# Altium schematic sheet [04] SQ3, SQ11.SchDoc
size 203 x 152 mm
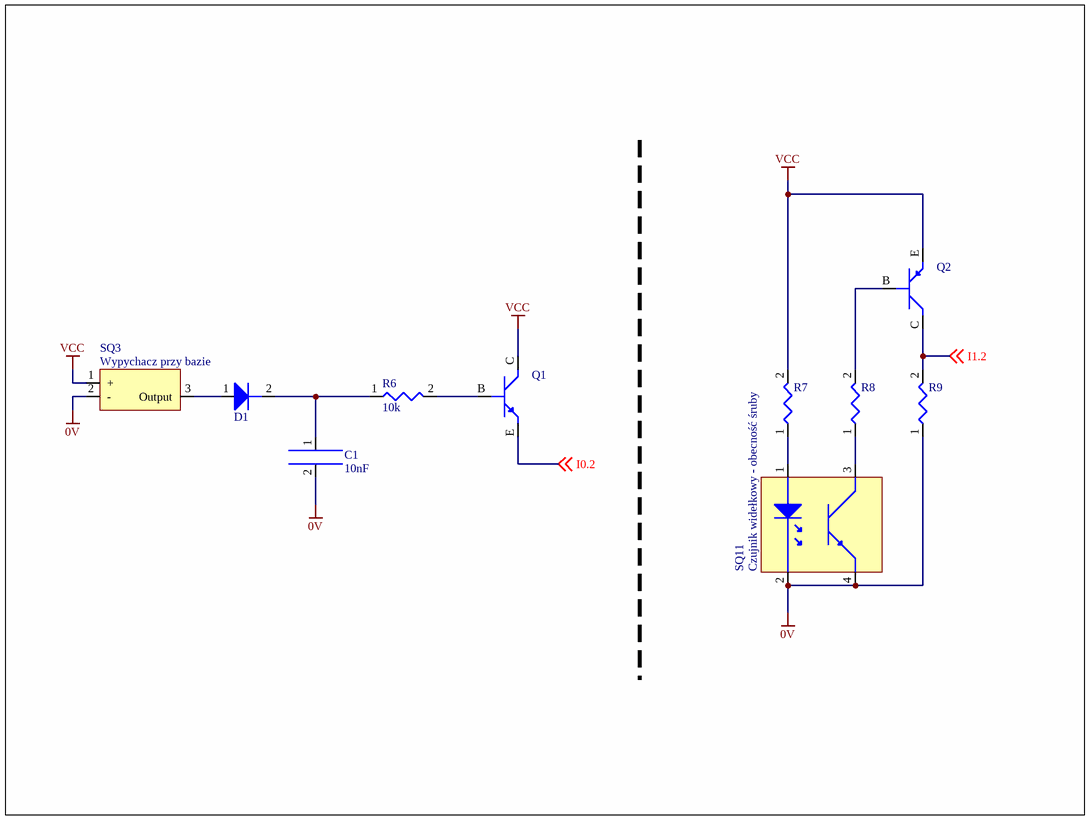
[diagram p0: [04] SQ3, SQ11.SchDoc]

## Parts
C1  10nF
D1  Dioda prostownicza  (value not drawn)
Q1  Transistor NPN  (value not drawn)
Q2  PNP Transistor  (value not drawn)
R6  10k
R7  ?R?  (value not drawn)
R8  ?R?  (value not drawn)
R9  ?R?  (value not drawn)
SQ3  Wypychacz przy bazie
SQ11  Czujnik widełkowy - obecność śruby

## Nets
0V: C1.2 R9.1 SQ3.2(-) SQ11.2(-) SQ11.4
VCC: Q1.C Q2.E R7.2 SQ3.1(+)
I0.2: Q1.E ; off-sheet I0.2
I1.2: Q2.C R9.2 ; off-sheet I1.2
NetC1_1: C1.1 D1.2(-) R6.1
NetD1_1: D1.1(+) SQ3.3(Output)
NetQ1_B: Q1.B R6.2
NetQ2_B: Q2.B R8.2
NetR7_1: R7.1 SQ11.1(+)
NetR8_1: R8.1 SQ11.3

## Library data of the parts
C1 = Condensator
D1 = Diode
R6-R9 = Resistor
SQ3 = Magnetic sensor PNP
SQ11 = Czujnik widełkowy